# EAGLE design PSU-rev.02 (EAGLE 6.6.0)
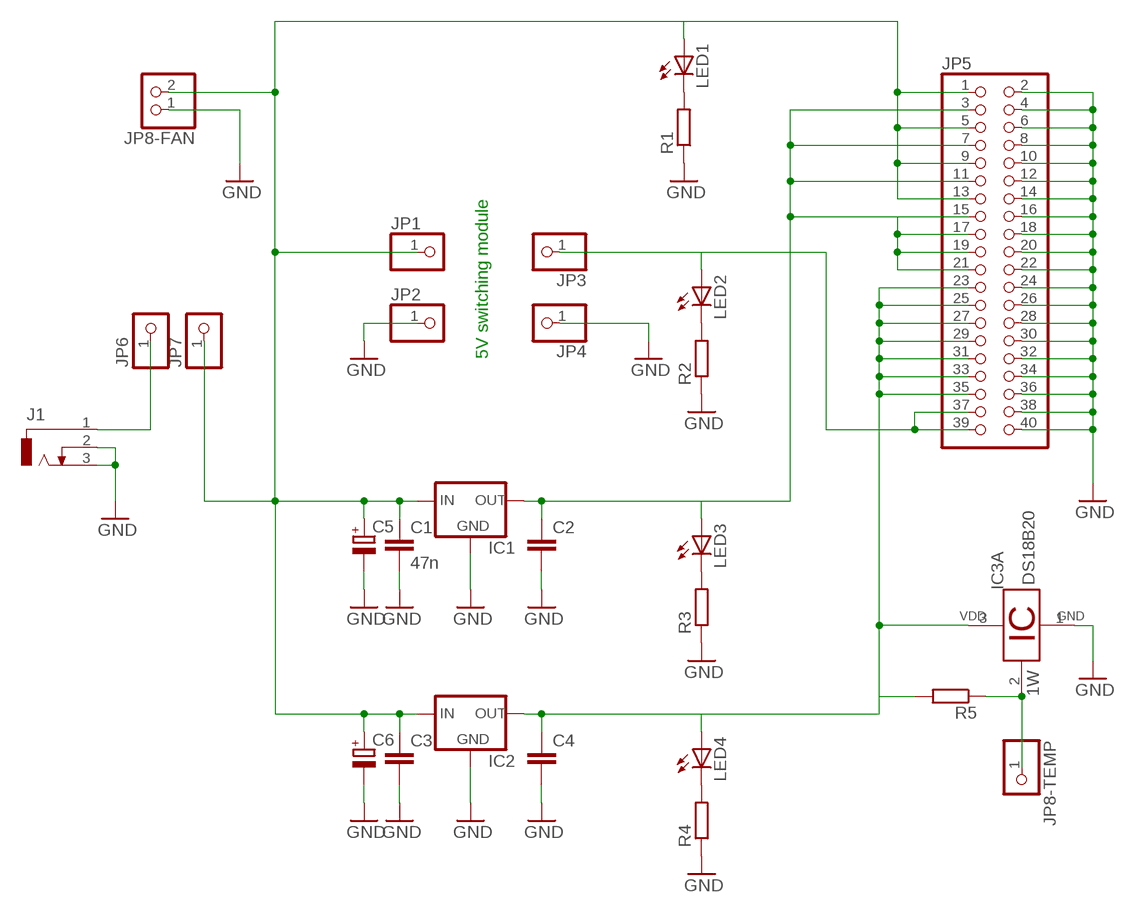
[diagram p0: schematic, sheet 1]

## Parts
C1  47n  C-EU050-024X044  [C050-024X044]
C2  C-EU050-024X044  [C050-024X044]
C3  C-EU050-024X044  [C050-024X044]
C4  C-EU050-024X044  [C050-024X044]
C5  CPOL-EUE3.5-8  [E3,5-8]
C6  CPOL-EUE3.5-8  [E3,5-8]
IC1  78XXL  [78XXL]
IC2  78XXL  [78XXL]
IC3  DS18B20  [TO92-]
J1  DCJ0303  [DCJ0303]
JP1  PINHD-1X1  [1X01]
JP2  PINHD-1X1  [1X01]
JP3  PINHD-1X1  [1X01]
JP4  PINHD-1X1  [1X01]
JP5  PINHD-2X20  [2X20]
JP6  PINHD-1X1  [1X01]
JP7  PINHD-1X1  [1X01]
JP8-FAN  PINHD-1X2  [1X02]
JP8-TEMP  PINHD-1X1  [1X01]
LED1  LEDSML1206  [SML1206]
LED2  LEDSML1206  [SML1206]
LED3  LEDSML1206  [SML1206]
LED4  LEDSML1206  [SML1206]
R1  R-EU_R1206  [R1206]
R2  R-EU_R1206  [R1206]
R3  R-EU_R1206  [R1206]
R4  R-EU_R1206  [R1206]
R5  R-EU_R1206  [R1206]

## Nets
GND: C1.2 C2.2 C3.2 C4.2 C5.- C6.- IC1.GND IC2.GND IC3.1 J1.2 J1.3 JP2.1 JP4.1 JP5.2 JP5.4 JP5.6 JP5.8 JP5.10 JP5.12 JP5.14 JP5.16 JP5.18 JP5.20 JP5.22 JP5.24 JP5.26 JP5.28 JP5.30 JP5.32 JP5.34 JP5.36 JP5.38 JP5.40 JP8-FAN.1 R1.1 R2.1 R3.1 R4.1
N$1: C1.1 C3.1 C5.+ C6.+ IC1.IN IC2.IN JP1.1 JP5.1 JP5.5 JP5.9 JP5.13 JP7.1 JP8-FAN.2 LED1.A
N$2: C2.1 IC1.OUT JP5.3 JP5.7 JP5.11 JP5.15 JP5.17 JP5.19 JP5.21 LED3.A
N$3: C4.1 IC2.OUT IC3.3 JP5.23 JP5.25 JP5.27 JP5.29 JP5.31 JP5.33 JP5.35 LED4.A R5.2
N$4: JP3.1 JP5.37 JP5.39 LED2.A
N$5: J1.1 JP6.1
N$6: IC3.2 JP8-TEMP.1 R5.1
N$7: LED1.C R1.2
N$8: LED2.C R2.2
N$9: LED3.C R3.2
N$10: LED4.C R4.2

## Notes on the sheet
- 5V switching module

## Library data of the parts
C1-C4 = resistor:C-EU: CAPACITOR, European symbol
C5 C6 = resistor:CPOL-EU: POLARIZED CAPACITOR, European symbol
IC1 IC2 = v-reg:78XXL: VOLTAGE REGULATOR
IC3 = ds18b20:DS18B20: Programmable Resolution Digital Thermometer This chip provides a onewire thermosensor with approx. 0.5°C accuracy. A programmable over/undertemperure alarm is available. The precision can be set from 9..12 bits. Notes: Vdd must be applied for accurate measurements at low temperatures, as the parasite power circuit otherwise heats the sensor. If parasite power is used, Vdd has to be connected to GND. The DS1822 is a low-cost thermometer chip, the DS18S20 is similar to the DS18B20, but with 9 Bit precision only. Author: Jan Kandziora <jjj@gmx.de>
J1 = con-jack:DCJ0303: DC POWER JACK Source: DCJ0303.pdf; OC_FARNELL: unknown; OC_NEWARK: unknown
JP1-JP4 JP6 JP7 JP8-TEMP = pinhead:PINHD-1X1: PIN HEADER
JP5 = pinhead:PINHD-2X20: PIN HEADER
JP8-FAN = pinhead:PINHD-1X2: PIN HEADER
LED1-LED4 = led:LED: LED OSRAM: - CHIPLED LG R971, LG N971, LY N971, LG Q971, LY Q971, LO R971, LY R971 LH N974, LH R974 LS Q976, LO Q976, LY Q976 LO Q996 - Hyper CHIPLED LW Q18S LB Q993, LB Q99A, LB R99A - SideLED LS A670, LO A670, LY A670, LG A670, LP A670 LB A673, LV A673, LT A673, LW A673 LH A674 LY A675 LS A676, LA A676, LO A676, LY A676, LW A676 LS A679, LY A679, LG A679 - Hyper Micro SIDELED® LS Y876, LA Y876, LO Y876, LY Y876 LT Y87S - SmartLED LW L88C, LW L88S LB L89C, LB L89S, LG L890 LS L89K, LO L89K, LY L89K LS L896, LA L896, LO L896, LY L896 - TOPLED LS T670, LO T670, LY T670, LG T670, LP T670 LSG T670, LSP T670, LSY T670, LOP T670, LYG T670 LG T671, LOG T671, LSG T671 LB T673, LV T673, LT T673, LW T673 LH T674 LS T676, LA T676, LO T676, LY T676, LB T676, LH T676, LSB T676, LW T676 LB T67C, LV T67C, LT T67C, LS T67K, LO T67K, LY T67K, LW E67C LS E67B, LA E67B, LO E67B, LY E67B, LB E67C, LV E67C, LT E67C LW T67C LS T679, LY T679, LG T679 LS T770, LO T770, LY T770, LG T770, LP T770 LB T773, LV T773, LT T773, LW T773 LH T774 LS E675, LA E675, LY E675, LS T675 LS T776, LA T776, LO T776, LY T776, LB T776 LHGB T686 LT T68C, LB T68C - Hyper Mini TOPLED® LB M676 - Mini TOPLED Santana® LG M470 LS M47K, LO M47K, LY M47K Source: http://www.osram.convergy.de LUXEON: - LUMILED® LXK2-PW12-R00, LXK2-PW12-S00, LXK2-PW14-U00, LXK2-PW14-V00 LXK2-PM12-R00, LXK2-PM12-S00, LXK2-PM14-U00 LXK2-PE12-Q00, LXK2-PE12-R00, LXK2-PE12-S00, LXK2-PE14-T00, LXK2-PE14-U00 LXK2-PB12-K00, LXK2-PB12-L00, LXK2-PB12-M00, LXK2-PB14-N00, LXK2-PB14-P00, LXK2-PB14-Q00 LXK2-PR12-L00, LXK2-PR12-M00, LXK2-PR14-Q00, LXK2-PR14-R00 LXK2-PD12-Q00, LXK2-PD12-R00, LXK2-PD12-S00 LXK2-PH12-R00, LXK2-PH12-S00 LXK2-PL12-P00, LXK2-PL12-Q00, LXK2-PL12-R00 Source: www.luxeon.com KINGBRIGHT: KA-3528ASYC Source: www.kingbright.com
R1-R5 = resistor:R-EU_: RESISTOR, European symbol

## Board
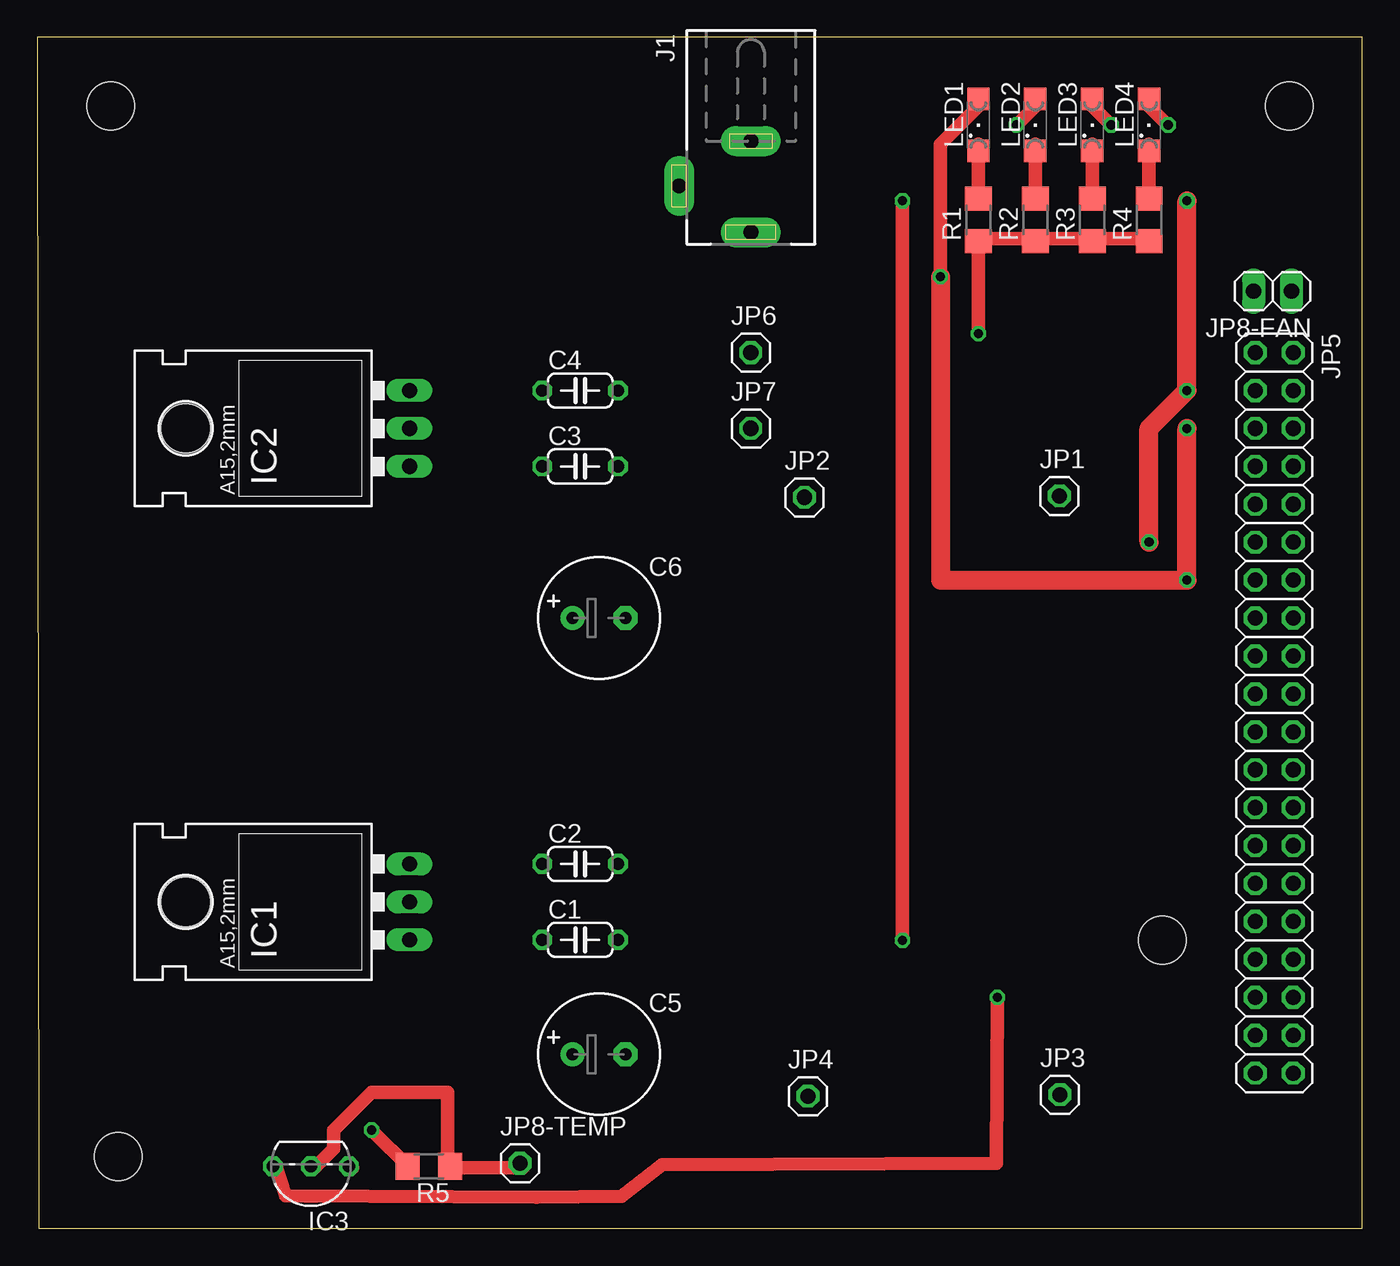
[diagram p1: board, top side]
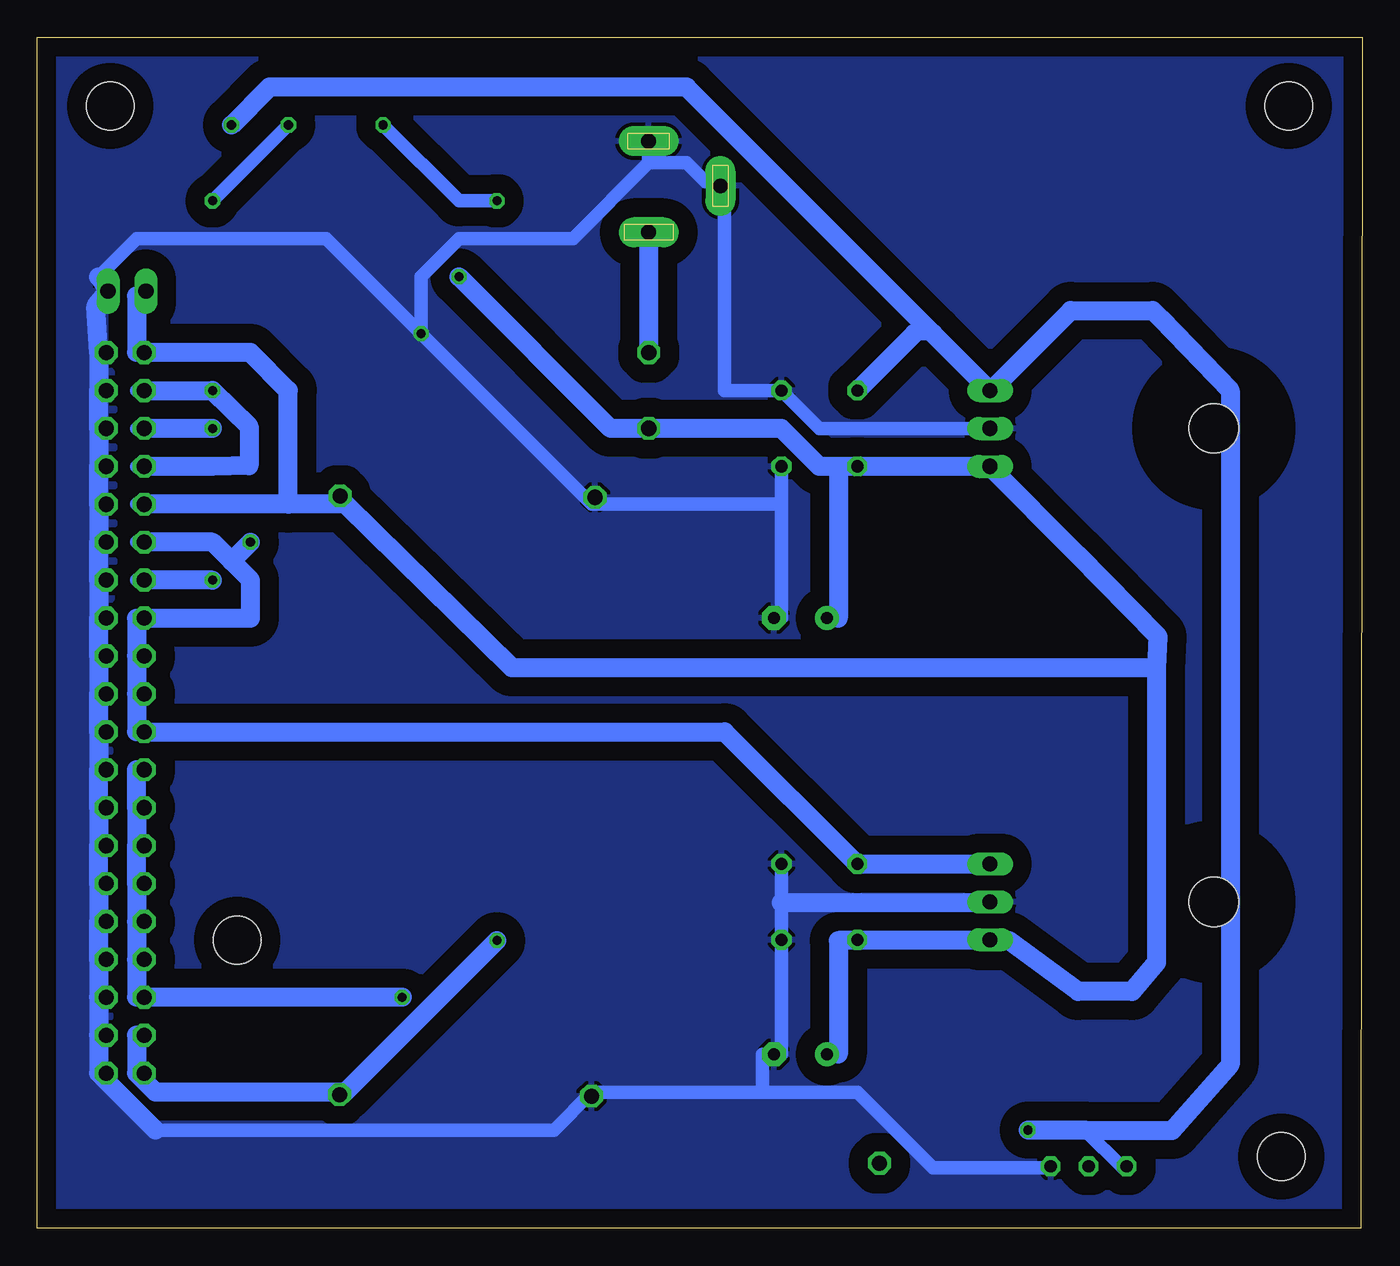
[diagram p2: board, bottom side, seen from below]

Size 88.72 x 79.76 mm. Coordinates in mm from the lower left corner, seen from the top.
Outline: 0.1,0 88.72,0 88.72,79.76 0,79.76 0.1,0
Copper layers (1*16): Top 0.035mm / dielectric 1.5mm / Bottom 0.035mm
Design rules "default *": minimum track width 35mil, minimum drill 24mil, track to track 16mil, track to pad 16mil, pad to pad 16mil, via to via 16mil, smd to smd 8mil, copper to edge 40mil, drill to drill 8mil, minimum pad ring 10mil, minimum via ring 8mil, stop-mask expansion 4mil, vias tented up to drill 0mil, thermal gap 10mil
Holes 3.2 mm at 5.41,4.81 4.91,75.16 83.84,75.16 75.34,19.31
tRestrict: area 19.8,46 to 28.7,62.5; area 31.3,48.5 to 41.4,58.6; area 40.2,63.7 to 52.9,75.2; area 46.5,51 to 49.1,61.2; area 33.8,38.3 to 42.7,43.4; area 22.4,16.7 to 28.7,30.7; area 32.5,19.3 to 40.2,29.4; area 33.3,9.6 to 42.2,13.4; area 48.7,5.8 to 53.8,12.2; area 67.3,5.8 to 71.1,12.2; area 65.3,45.4 to 70.4,50.5; area 78.7,7.9 to 86.3,61.2; 1 more areas

### Footprints (pad centres in the part's own frame; a part is rotated, then mirrored left to right if it is on the bottom)
C050-024X044 = drill 0.813 octagon: 1 -2.54,0; 2 2.54,0
E3,5-8 = drill 0.813 pad 1.6: + -1.778,0 | drill 0.813 pad 1.6 octagon: - 1.778,0
78XXL = drill 1.016 long: GND 0,-3.81; IN -2.54,-3.81; OUT 2.54,-3.81 | hole 3.302: 0,11.176
TO92- = drill 0.813 octagon: 1 -2.54,0; 2 0,0; 3 2.54,0
DCJ0303 = drill 1 pad 2 long: 1 0,3.1; 2 4.8,0; 3 0,-3
1X01 = drill 1.016 octagon: 1 0,0
2X20 = drill 1.016 octagon: 1 -24.13,-1.27; 2 -24.13,1.27; 3 -21.59,-1.27; 4 -21.59,1.27; 5 -19.05,-1.27; 6 -19.05,1.27; 7 -16.51,-1.27; 8 -16.51,1.27; 9 -13.97,-1.27; 10 -13.97,1.27; 11 -11.43,-1.27; 12 -11.43,1.27; 13 -8.89,-1.27; 14 -8.89,1.27; 15 -6.35,-1.27; 16 -6.35,1.27; 17 -3.81,-1.27; 18 -3.81,1.27; 19 -1.27,-1.27; 20 -1.27,1.27; 21 1.27,-1.27; 22 1.27,1.27; 23 3.81,-1.27; 24 3.81,1.27; 25 6.35,-1.27; 26 6.35,1.27; 27 8.89,-1.27; 28 8.89,1.27; 29 11.43,-1.27; 30 11.43,1.27; 31 13.97,-1.27; 32 13.97,1.27; 33 16.51,-1.27; 34 16.51,1.27; 35 19.05,-1.27; 36 19.05,1.27; 37 21.59,-1.27; 38 21.59,1.27; 39 24.13,-1.27; 40 24.13,1.27
1X02 = drill 1.016 long: 1 -1.27,0; 2 1.27,0
SML1206 = smd 1.5 x 1.5: A 1.75,0; C -1.75,0
R1206 = smd 1.6 x 1.803: 1 -1.422,0; 2 1.422,0

### Placement (x,y rotation side)
C1  36.35,19.32 0 top
C2  36.35,24.4 0 top
C3  36.35,51.03 0 top
C4  36.35,56.11 0 top
C5  37.62,11.66 0 top
C6  37.62,40.87 0 top
IC1  21.11,21.86 90 top
IC2  21.11,53.57 90 top
IC3  18.32,4.16 180 top
J1  47.78,69.81 180 top
JP1  68.45,49.05 0 top
JP2  51.37,48.95 0 top
JP3  68.48,8.95 0 top
JP4  51.6,8.85 0 top
JP5  82.83,34.52 270 top
JP6  47.78,58.65 0 top
JP7  47.78,53.57 0 top
JP8-FAN  82.72,62.76 180 top
JP8-TEMP  32.32,4.36 0 top
LED1  63.02,73.89 90 top
LED2  66.83,73.89 90 top
LED3  70.64,73.89 90 top
LED4  74.45,73.89 90 top
R1  63.02,67.54 90 top
R2  66.83,67.54 90 top
R3  70.64,67.54 90 top
R4  74.45,67.54 90 top
R5  26.22,4.16 180 top

### Tracks (layer width: path | path; a pad name or v marks a point on that pad's centre or on a via)
GND  (via drill 0.61)
  Top 0.889: 66.83,66.27 63.02,66.27 R1.1 v63.02,59.92 | 66.83,66.27 70.64,66.27 | 66.83,66.27 R2.1 | 70.64,66.27 74.45,66.27 R4.1 | 70.64,66.27 R3.1 | 21.11,4.04 IC3.1
  Bottom 0.889: 47.78,71.35 45.24,71.35 43.97,70.08 J1.2 42.7,68.81 42.7,56.11 C4.2 36.35,53.57 IC2.GND | 38.89,48.49 38.89,40.87 C6.- | 38.89,48.49 C3.2 | 38.89,48.49 51.59,48.49 | 51.59,48.49 v63.02,59.92 | 51.59,48.49 JP2.1 | 47.78,71.35 52.86,66.27 60.48,66.27 63.02,63.73 v63.02,59.92 | 47.78,71.35 J1.3 | C2.2 38.89,21.82 C1.2 38.89,11.66 C5.- 40.16,11.66 40.16,9.12 | 24.92,21.82 IC1.GND | 51.59,9.12 40.16,9.12 | 40.16,9.12 33.81,9.12 28.73,4.04 21.11,4.04 IC3.1 | 84.61,58.65 JP5.2 | 84.61,12.93 JP5.38 | 84.61,15.47 JP5.36 | 84.61,20.55 JP5.32 | 84.61,18.01 JP5.34 | 84.61,25.63 JP5.28 | 84.61,23.09 JP5.30 | 84.61,30.71 JP5.24 | 84.61,28.17 JP5.26 | 84.61,35.79 JP5.20 | 84.61,33.25 JP5.22 | 84.61,40.87 JP5.16 | 84.61,38.33 JP5.18 | 84.61,45.95 JP5.12 | 84.61,43.41 JP5.14 | 84.61,51.03 JP5.8 | 84.61,48.49 JP5.10 | 84.61,56.11 JP5.4 | 84.61,53.57 JP5.6 | 51.59,9.12 54.13,6.58 80.8,6.58 | 51.59,9.12 JP4.1 | 84.61,10.39 JP5.40 | v63.02,59.92 69.37,66.27 82.07,66.27 84.61,63.73
  Bottom 1.27: 38.89,21.82 24.92,21.82 | 80.8,6.58 84.61,10.39 84.61,12.93 84.61,15.47 84.61,18.01 84.61,20.55 84.61,23.09 84.61,25.63 84.61,28.17 84.61,30.71 84.61,33.25 84.61,35.79 84.61,38.33 84.61,40.87 84.61,43.41 84.61,45.95 84.61,48.49 84.61,51.03 84.61,53.57 84.61,56.11 84.61,58.65 84.81,61.76 JP8-FAN.1 84.61,63.73
  pour Bottom (isolate 1.27): -0.08,80.76 89.22,80.76 89.22,-0.44 -0.08,-0.44
N$1  (via drill 0.61)
  Top 0.889: v60.48,63.73 60.48,72.62 63.02,75.16 LED1.A
  Top 1.27: v60.48,63.73 60.48,43.41 v76.99,43.41 v76.99,53.57
  Bottom 0.889: 82.07,43.41 JP5.13 | 82.07,53.57 JP5.5 | 82.07,62.46 JP8-FAN.2 | 82.07,48.49 JP5.9 | 82.07,58.65 JP5.1 | 35.08,11.66 C5.+ | 33.81,19.28 C1.1 | 35.08,40.87 C6.+ | 23.65,19.28 24.92,19.28 IC1.IN | 68.1,48.49 JP1.1
  Bottom 1.27: v60.48,63.73 50.32,53.57 JP7.1 38.89,53.57 36.35,51.03 35.08,51.03 | v76.99,43.41 JP5.13 | v76.99,53.57 JP5.5 | 82.07,62.46 82.07,58.65 | 71.91,48.49 68.1,48.49 56.94,37.53 13.78,37.53 | 71.91,48.49 JP5.9 | JP5.1 74.45,58.65 71.91,56.11 71.91,48.49 | 24.92,19.28 33.81,19.28 35.08,19.28 35.08,11.66 | 35.08,51.03 35.08,40.87 | 35.08,51.03 C3.1 IC2.IN 19.12,45.16 13.68,39.62 13.78,37.53 | 23.65,19.28 19.02,15.86 15.42,15.86 13.78,17.8 13.78,37.53
N$2  (via drill 0.61)
  Top 0.889: v71.91,73.89 70.64,75.16 LED3.A
  Top 1.27: v76.99,68.81 v76.99,56.11 74.45,53.57 v74.45,45.95
  Bottom 0.889: v76.99,68.81 v71.91,73.89 | 82.07,56.11 JP5.3 | 82.07,51.03 JP5.7 | 24.92,24.36 IC1.OUT | 82.07,45.95 JP5.11 | 82.07,40.87 JP5.15 | 82.07,35.79 JP5.19 | 82.07,38.33 JP5.17 | 33.81,24.36 C2.1 | 82.07,33.25 JP5.21
  Bottom 1.27: JP5.3 v76.99,56.11 74.55,53.71 74.55,51.07 76.99,51.03 JP5.7 | 24.92,24.36 33.81,24.36 42.7,33.25 JP5.21 | 82.07,33.25 82.07,35.79 82.07,38.33 82.07,40.87 | JP5.11 76.99,45.95 75.72,44.68 | 75.72,44.68 74.45,43.41 74.45,40.87 JP5.15 | 75.72,44.68 v74.45,45.95
N$3  (via drill 0.61)
  Top 0.889: v22.38,6.58 24.92,4.04 R5.2 | v75.72,73.89 74.45,75.16 LED4.A | v64.29,15.47 64.22,4.36 41.82,4.27 39.12,2.16 33.42,2.07 16.63,2.17 16.03,4.04 IC3.3
  Bottom 0.889: 82.07,30.71 JP5.23 | 82.07,28.17 JP5.25 | 82.07,18.01 JP5.33 | 82.07,20.55 JP5.31 | 82.07,25.63 JP5.27 | 82.07,23.09 JP5.29 | 18.57,6.58 16.03,4.04 IC3.3 | 28.73,59.92 30,59.92 | IC2.OUT 24.87,56.11 | 82.07,15.47 JP5.35
  Bottom 1.27: 82.07,30.71 82.07,28.17 82.07,25.63 82.07,23.09 82.07,20.55 82.07,18.01 82.07,15.47 | v22.38,6.58 18.57,6.58 12.72,6.56 8.84,10.96 8.84,56.11 13.52,60.96 14.02,61.46 19.52,61.46 24.87,56.11 | v75.72,73.89 73.18,76.43 45.24,76.43 28.73,59.92 IC2.OUT | 30,59.92 C4.1 | v64.29,15.47 JP5.35
N$4  (via drill 0.61)
  Top 0.889: v65.56,73.89 66.83,75.16 LED2.A | v57.94,19.28 v57.94,68.81
  Bottom 0.889: 82.07,12.93 JP5.37 | v65.56,73.89 60.48,68.81 v57.94,68.81 | 82.07,10.39 JP5.39 | 68.1,9.12 JP3.1
  Bottom 1.27: 82.07,12.93 82.07,10.39 80.8,9.12 68.1,9.12 v57.94,19.28
N$5
  Bottom 0.889: 47.78,66.27 J1.1
  Bottom 1.27: J1.1 JP6.1
N$6
  Top 0.889: 27.46,4.04 32.54,4.04 JP8-TEMP.1 | 27.46,4.04 27.46,9.12 22.38,9.12 19.84,6.58 19.84,5.31 18.57,4.04 IC3.2 | 27.46,4.04 R5.1
N$7
  Top 0.889: 63.02,72.62 LED1.C R1.2 63.02,68.81
N$8
  Top 0.889: 66.83,72.62 LED2.C R2.2 66.83,68.81
N$9
  Top 0.889: 70.64,72.62 LED3.C R3.2 70.64,68.81
N$10
  Top 0.889: 74.45,72.62 LED4.C R4.2 74.45,68.81